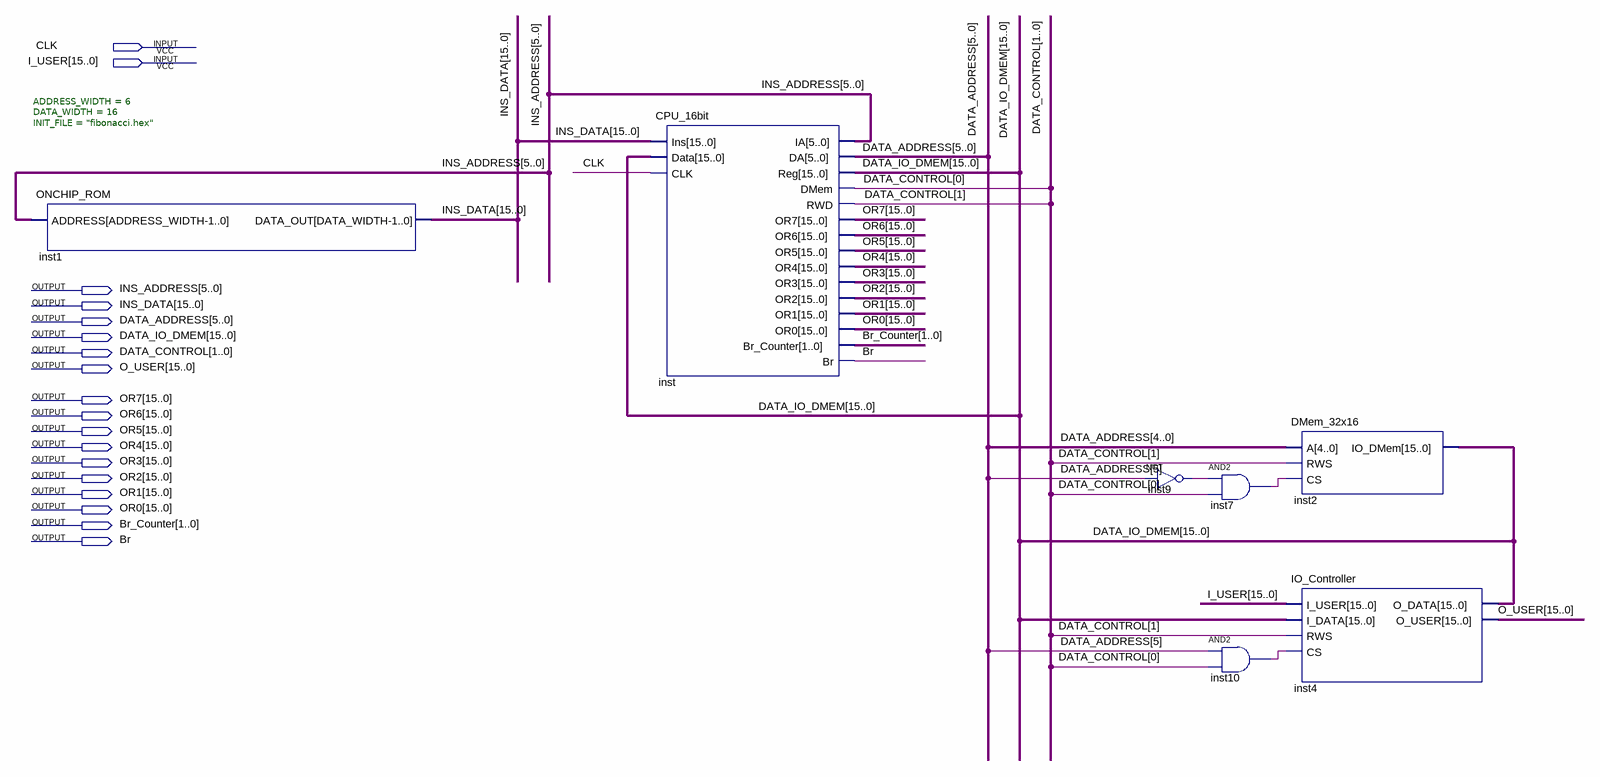
[diagram p0: schematic sheet]
// Quartus schematic Datapath.bdf as structural Verilog: 7 symbols, 18 pins
module Datapath (
  input  CLK,
  input  [15:0] I_USER,
  output [5:0] INS_ADDRESS,
  output [15:0] INS_DATA,
  output [5:0] DATA_ADDRESS,
  output [15:0] DATA_IO_DMEM,
  output [1:0] DATA_CONTROL,
  output [15:0] O_USER,
  output [15:0] OR7,
  output [15:0] OR6,
  output [15:0] OR5,
  output [15:0] OR4,
  output [15:0] OR3,
  output [15:0] OR2,
  output [15:0] OR1,
  output [15:0] OR0,
  output [1:0] Br_Counter,
  output Br
);

  wire inst7_out, inst9_out, inst10_out;

  ONCHIP_ROM #(.ADDRESS_WIDTH(6), .DATA_WIDTH(16), .INIT_FILE("fibonacci.hex")) inst1 (
    .ADDRESS(INS_ADDRESS), .DATA_OUT(INS_DATA));
  CPU_16bit inst (
    .Ins(INS_DATA), .Data(DATA_IO_DMEM), .CLK(CLK), .IA(INS_ADDRESS), .DA(DATA_ADDRESS), .Reg(DATA_IO_DMEM),
    .DMem(DATA_CONTROL[0]), .RWD(DATA_CONTROL[1]), .OR7(OR7), .OR6(OR6), .OR5(OR5), .OR4(OR4), .OR3(OR3),
    .OR2(OR2), .OR1(OR1), .OR0(OR0), .Br_Counter(Br_Counter), .Br(Br));
  not inst9 (inst9_out, DATA_ADDRESS[5]);
  and inst7 (inst7_out, inst9_out, DATA_CONTROL[0]);
  and inst10 (inst10_out, DATA_ADDRESS[5], DATA_CONTROL[0]);
  DMem_32x16 inst2 (.A(DATA_ADDRESS[4:0]), .RWS(DATA_CONTROL[1]), .CS(inst7_out), .IO_DMem(DATA_IO_DMEM));
  IO_Controller inst4 (
    .I_USER(I_USER), .I_DATA(DATA_IO_DMEM), .RWS(DATA_CONTROL[1]), .CS(inst10_out), .O_DATA(DATA_IO_DMEM),
    .O_USER(O_USER));
endmodule
